# Altium schematic sheet esp32.SchDoc
size A4
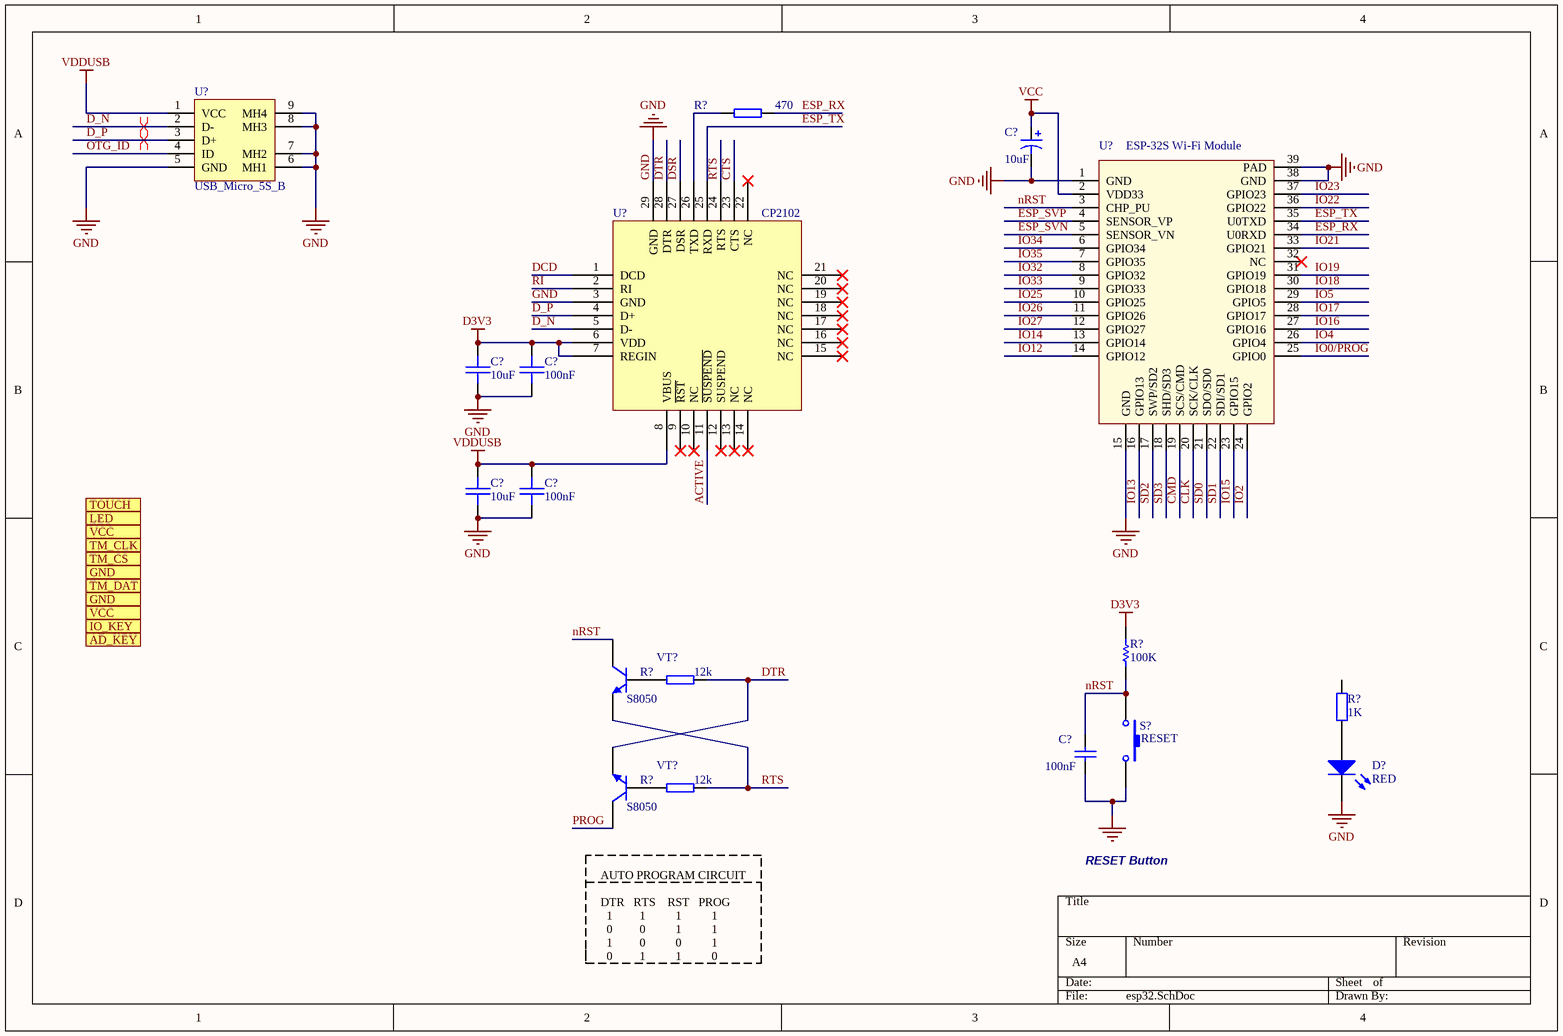
[diagram p0: esp32.SchDoc]

## Parts
(Parts that share a designator on the sheet are numbered #1, #2 ... from top to bottom, then left to right.)
C?#1  10uF  [1210]
C?#2  10uF  [C0603L]
C?#3  100nF  [C0603L]
C?#4  10uF  [C0603L]
C?#5  100nF  [C0603L]
C?#6  100nF  [C0603L]
D?  RED  [SMT_LED_0603]
R?#1  470  [R0603]
R?#2  100K  [R0603]
R?#3  12k  [R0603]
R?#4  1K  [R0603]
R?#5  12k  [R0603]
S?  RESET  [KEY-2x4-SMD]
U?#1  USB_Micro_5S_B  [USB_MICRO_5S_B]
U?#2  ESP-32S Wi-Fi Module  [ESP-32S]
U?#3  CP2102  [QFN28]
VT?#1  S8050  [SMT_TRIODE_NPN]
VT?#2  S8050  [SMT_TRIODE_NPN]

## Ports
AD_KEY (in), GND (out), IO_KEY (in), LED (out), TM_CLK (out), TM_CS (out), TM_DAT (out), TOUCH (out), VCC (out)

## Nets
D3V3: C?#2.1 C?#3.1 R?#2.2 U?#3.6(VDD) U?#3.7(REGIN)
GND: C?#1.2 C?#2.2 C?#3.2 C?#4.2 C?#5.2 C?#6.1 D?.2(K) S?.1 U?#1.5(GND) U?#1.6(MH1) U?#1.7(MH2) U?#1.8(MH3) U?#1.9(MH4) U?#2.1(GND) U?#2.15(GND) U?#2.38(GND) U?#2.39(PAD) U?#3.3(GND) U?#3.29(GND)
VCC: C?#1.1 U?#2.2(VDD33)
VDDUSB: C?#4.1 C?#5.1 U?#1.1(VCC) U?#3.8(VBUS)
ACTIVE: U?#3.11(~{SUSPEND})
CLK: U?#2.20(SCK/CLK)
CMD: U?#2.19(SCS/CMD)
CTS: U?#3.23(CTS)
D_N: U?#1.2(D-) U?#3.5(D-)
D_P: U?#1.3(D+) U?#3.4(D+)
DCD: U?#3.1(DCD)
DSR: U?#3.27(DSR)
DTR: R?#3.2 U?#3.28(DTR) VT?#2.2(E)
ESP_RX: R?#1.2 U?#2.34(U0RXD)
ESP_SVN: U?#2.5(SENSOR_VN)
ESP_SVP: U?#2.4(SENSOR_VP)
ESP_TX: U?#2.35(U0TXD) U?#3.25(RXD)
IO0/PROG: U?#2.25(GPIO0)
IO2: U?#2.24(GPIO2)
IO4: U?#2.26(GPIO4)
IO5: U?#2.29(GPIO5)
IO12: U?#2.14(GPIO12)
IO13: U?#2.16(GPIO13)
IO14: U?#2.13(GPIO14)
IO15: U?#2.23(GPIO15)
IO16: U?#2.27(GPIO16)
IO17: U?#2.28(GPIO17)
IO18: U?#2.30(GPIO18)
IO19: U?#2.31(GPIO19)
IO21: U?#2.33(GPIO21)
IO22: U?#2.36(GPIO22)
IO23: U?#2.37(GPIO23)
IO25: U?#2.10(GPIO25)
IO26: U?#2.11(GPIO26)
IO27: U?#2.12(GPIO27)
IO32: U?#2.8(GPIO32)
IO33: U?#2.9(GPIO33)
IO34: U?#2.6(GPIO34)
IO35: U?#2.7(GPIO35)
nRST: C?#6.2 R?#2.1 S?.2 U?#2.3(CHP_PU) VT?#1.3(C)
OTG_ID: U?#1.4(ID)
PROG: VT?#2.3(C)
RI: U?#3.2(RI)
RTS: R?#5.2 U?#3.24(RTS) VT?#1.2(E)
SD0: U?#2.21(SDO/SD0)
SD1: U?#2.22(SDI/SD1)
SD2: U?#2.17(SWP/SD2)
SD3: U?#2.18(SHD/SD3)
NetD?_1: D?.1(A) R?#4.1
NetR?#1_1: R?#1.1 U?#3.26(TXD)
NetR?#3_1: R?#3.1 VT?#1.1(B)
NetR?#5_1: R?#5.1 VT?#2.1(B)

Not connected (* = marked no-connect by the designer): R?#4 2; U?#2 32(NC)*; U?#3 9(~{RST})* 10(NC)* 12(SUSPEND)* 13(NC)* 14(NC)* 15(NC)* 16(NC)* 17(NC)* 18(NC)* 19(NC)* 20(NC)* 21(NC)* 22(NC)*

## Layout directives
differential pair: D_N, D_P

## Notes on the sheet
- RESET Button
- AUTO PROGRAM CIRCUIT
  DTR   RTS    RST   PROG
  1         1          1          1
  0         0          1          1
  1         0          0          1
  0         1          1          0

## Library data of the parts
C?#1 = Cap Pol2: Polarized Capacitor (Axial); Published: 8-Jun-2000; LatestRevisionDate: 17-Jul-2002; LatestRevisionNote: Re-released for DXP Platform.; PackageReference: POLAR0.8; Publisher: Altium Limited; Value: 10uF
C?#2-C?#5 = SMT_C_0402: Surface mount capacitor 0402
C?#6 = CAP: Capacitor; Published: 8-Jun-2000; Revision: July-2002: Re-released for DXP Platform.; Publisher: Altium Limited; Value: 100nF
D? = LED0: Typical INFRARED GaAs LED; Published: 8-Jun-2000; LatestRevisionDate: 08-Jul-2005; LatestRevisionNote: Mech Layer 1 removed.; PackageReference: LED-0; Publisher: Altium Limited
R?#1 R?#3 R?#5 = SMT_R_0402: Surface mount resistor 0402
R?#2 = res1: Resistor; Fitted: NO; Published: 8-Jun-2000; Revision: July-2002: Re-released for DXP Platform.; Publisher: Altium Limited; Value: 100K
R?#4 = Res2: Resistor; Published: 8-Jun-2000; LatestRevisionDate: 17-Jul-2002; LatestRevisionNote: Re-released for DXP Platform.; PackageReference: AXIAL-0.4; Publisher: Altium Limited; Value: 1K
S? = SW-PB: Switch; Published: 24-Mar-1999; LatestRevisionDate: 17-Jul-2002; LatestRevisionNote: Re-released for DXP Platform.; PackageReference: SPST-2; Publisher: Altium Limited
U?#1 = USB_Micro_5S_B: USB micro female SMT with 4 fixed foot
U?#2 = ESP-32S
VT?#1 VT?#2 = SMT_TRIODE_NPN: Surface mount NPN transistor, package SOT-23